# EAGLE schematic untitled (EAGLE 7.1.0)
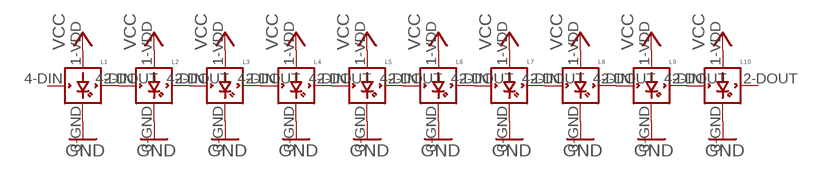
[diagram p0: schematic, sheet 1]

## Parts
L1  WS2812B  [WS2812B]
L2  WS2812B  [WS2812B]
L3  WS2812B  [WS2812B]
L4  WS2812B  [WS2812B]
L5  WS2812B  [WS2812B]
L6  WS2812B  [WS2812B]
L7  WS2812B  [WS2812B]
L8  WS2812B  [WS2812B]
L9  WS2812B  [WS2812B]
L10  WS2812B  [WS2812B]

## Nets
GND: L1.3-GND(GND) L2.3-GND(GND) L3.3-GND(GND) L4.3-GND(GND) L5.3-GND(GND) L6.3-GND(GND) L7.3-GND(GND) L8.3-GND(GND) L9.3-GND(GND) L10.3-GND(GND)
N$1: L1.2-DOUT(DOUT) L2.4-DIN(DIN)
N$2: L3.2-DOUT(DOUT) L4.4-DIN(DIN)
N$3: L5.2-DOUT(DOUT) L6.4-DIN(DIN)
N$4: L7.2-DOUT(DOUT) L8.4-DIN(DIN)
N$5: L8.2-DOUT(DOUT) L9.4-DIN(DIN)
N$6: L9.2-DOUT(DOUT) L10.4-DIN(DIN)
VCC: L1.1-VDD(VDD) L2.1-VDD(VDD) L3.1-VDD(VDD) L4.1-VDD(VDD) L5.1-VDD(VDD) L6.1-VDD(VDD) L7.1-VDD(VDD) L8.1-VDD(VDD) L9.1-VDD(VDD) L10.1-VDD(VDD)
Unconnected: L1.4-DIN(DIN) L2.2-DOUT(DOUT) L3.4-DIN(DIN) L4.2-DOUT(DOUT) L5.4-DIN(DIN) L6.2-DOUT(DOUT) L7.4-DIN(DIN) L10.2-DOUT(DOUT)

## Library data of the parts
L1-L10 = adafruit:WS2812B